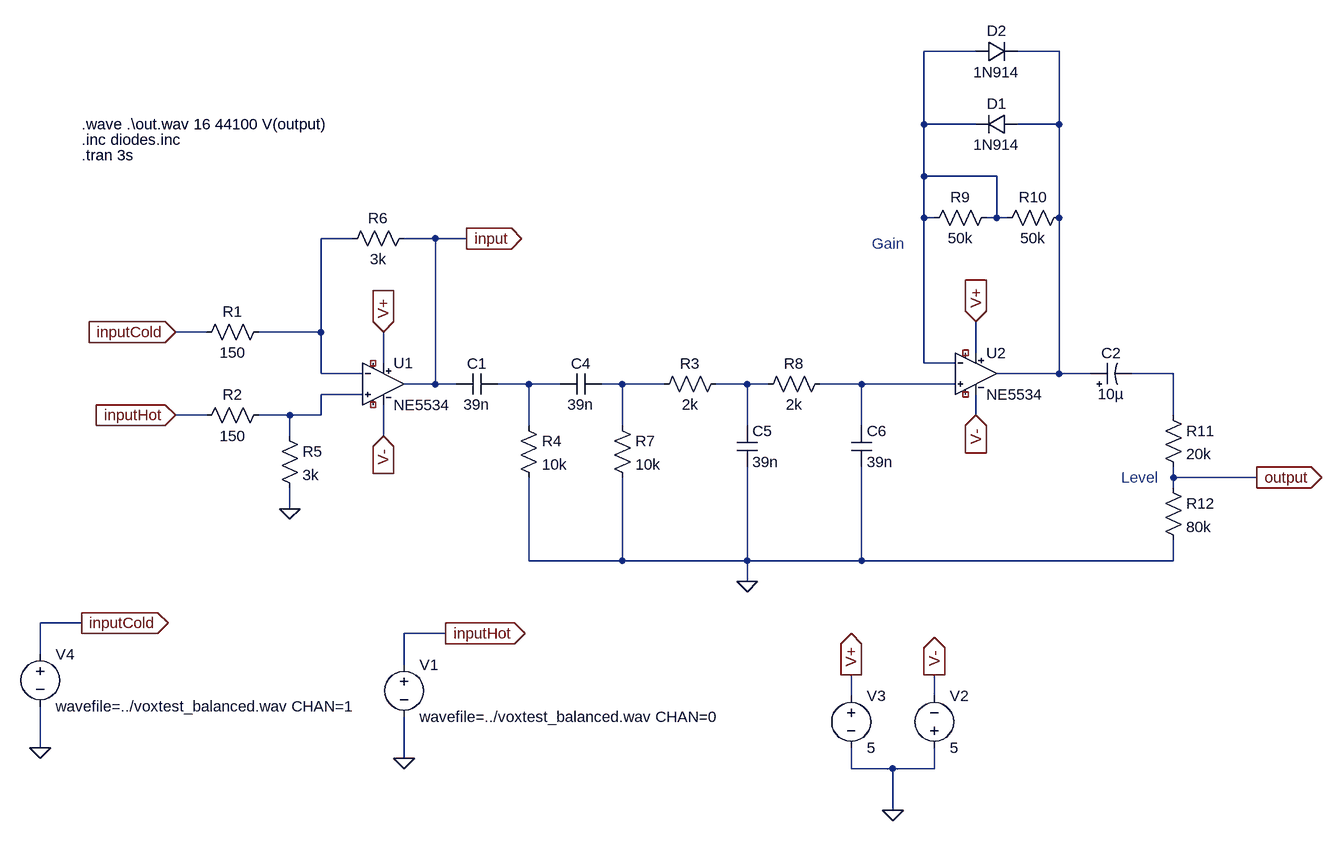
[diagram p0: schematic Telephoner.asc]
Telephoner.asc, the LTspice schematic file:
Version 4
SHEET 1 1324 900
WIRE -3984 -1632 -4064 -1632
WIRE -3856 -1632 -3920 -1632
WIRE -4064 -1520 -4064 -1632
WIRE -3984 -1520 -4064 -1520
WIRE -3856 -1520 -3856 -1632
WIRE -3856 -1520 -3920 -1520
WIRE -4064 -1440 -4064 -1520
WIRE -3952 -1440 -4064 -1440
WIRE -4064 -1376 -4064 -1440
WIRE -4048 -1376 -4064 -1376
WIRE -3952 -1376 -3952 -1440
WIRE -3952 -1376 -3968 -1376
WIRE -3936 -1376 -3952 -1376
WIRE -3856 -1376 -3856 -1520
WIRE -4944 -1344 -4992 -1344
WIRE -4816 -1344 -4864 -1344
WIRE -4768 -1344 -4816 -1344
WIRE -5168 -1200 -5216 -1200
WIRE -4992 -1200 -4992 -1344
WIRE -4992 -1200 -5088 -1200
WIRE -3984 -1168 -3984 -1216
WIRE -4896 -1152 -4896 -1200
WIRE -4064 -1152 -4064 -1376
WIRE -4016 -1152 -4064 -1152
WIRE -4992 -1136 -4992 -1200
WIRE -4928 -1136 -4992 -1136
WIRE -3856 -1136 -3856 -1376
WIRE -3856 -1136 -3952 -1136
WIRE -3808 -1136 -3856 -1136
WIRE -3680 -1136 -3744 -1136
WIRE -4816 -1120 -4816 -1344
WIRE -4816 -1120 -4864 -1120
WIRE -4784 -1120 -4816 -1120
WIRE -4672 -1120 -4720 -1120
WIRE -4624 -1120 -4672 -1120
WIRE -4528 -1120 -4560 -1120
WIRE -4464 -1120 -4528 -1120
WIRE -4336 -1120 -4384 -1120
WIRE -4304 -1120 -4336 -1120
WIRE -4160 -1120 -4224 -1120
WIRE -4016 -1120 -4160 -1120
WIRE -4928 -1104 -4992 -1104
WIRE -5168 -1072 -5216 -1072
WIRE -5040 -1072 -5088 -1072
WIRE -4992 -1072 -4992 -1104
WIRE -4992 -1072 -5040 -1072
WIRE -3984 -1072 -3984 -1104
WIRE -3680 -1072 -3680 -1136
WIRE -4672 -1056 -4672 -1120
WIRE -4528 -1056 -4528 -1120
WIRE -4336 -1056 -4336 -1120
WIRE -4160 -1056 -4160 -1120
WIRE -5040 -1040 -5040 -1072
WIRE -4896 -1040 -4896 -1088
WIRE -3680 -976 -3680 -992
WIRE -3552 -976 -3680 -976
WIRE -3680 -960 -3680 -976
WIRE -5040 -928 -5040 -960
WIRE -4672 -848 -4672 -976
WIRE -4528 -848 -4528 -976
WIRE -4528 -848 -4672 -848
WIRE -4336 -848 -4336 -992
WIRE -4336 -848 -4528 -848
WIRE -4160 -848 -4160 -992
WIRE -4160 -848 -4336 -848
WIRE -3680 -848 -3680 -880
WIRE -3680 -848 -4160 -848
WIRE -4336 -816 -4336 -848
WIRE -5360 -752 -5424 -752
WIRE -4800 -736 -4864 -736
WIRE -5424 -704 -5424 -752
WIRE -4864 -688 -4864 -736
WIRE -4176 -640 -4176 -672
WIRE -4048 -640 -4048 -672
WIRE -5424 -560 -5424 -624
WIRE -4864 -544 -4864 -608
WIRE -4176 -528 -4176 -560
WIRE -4112 -528 -4176 -528
WIRE -4048 -528 -4048 -560
WIRE -4048 -528 -4112 -528
WIRE -4112 -464 -4112 -528
FLAG -4864 -544 0
FLAG -4800 -736 inputHot
IOPIN -4800 -736 Out
FLAG -5216 -1072 inputHot
IOPIN -5216 -1072 In
FLAG -4176 -672 V+
IOPIN -4176 -672 Out
FLAG -4336 -816 0
FLAG -3984 -1216 V+
IOPIN -3984 -1216 In
FLAG -3984 -1072 V-
IOPIN -3984 -1072 In
FLAG -4048 -672 V-
IOPIN -4048 -672 Out
FLAG -4112 -464 0
FLAG -5424 -560 0
FLAG -5360 -752 inputCold
IOPIN -5360 -752 Out
FLAG -5216 -1200 inputCold
IOPIN -5216 -1200 In
FLAG -5040 -928 0
FLAG -4896 -1200 V+
IOPIN -4896 -1200 In
FLAG -4896 -1040 V-
IOPIN -4896 -1040 In
FLAG -3552 -976 output
IOPIN -3552 -976 Out
FLAG -4768 -1344 input
IOPIN -4768 -1344 Out
SYMBOL voltage -4864 -704 R0
SYMATTR InstName V1
SYMATTR Value wavefile=../voxtest_balanced.wav CHAN=0
SYMBOL voltage -4176 -656 R0
WINDOW 123 0 0 Left 2
WINDOW 39 0 0 Left 2
SYMATTR InstName V3
SYMATTR Value 5
SYMBOL cap -4720 -1136 R90
WINDOW 0 0 32 VBottom 2
WINDOW 3 32 32 VTop 2
SYMATTR InstName C1
SYMATTR Value 39n
SYMBOL cap -4560 -1136 R90
WINDOW 0 0 32 VBottom 2
WINDOW 3 32 32 VTop 2
SYMATTR InstName C4
SYMATTR Value 39n
SYMBOL res -4688 -1072 R0
SYMATTR InstName R4
SYMATTR Value 10k
SYMBOL res -4544 -1072 R0
SYMATTR InstName R7
SYMATTR Value 10k
SYMBOL res -4368 -1136 R90
WINDOW 0 0 56 VBottom 2
WINDOW 3 32 56 VTop 2
SYMATTR InstName R3
SYMATTR Value 2k
SYMBOL res -4208 -1136 R90
WINDOW 0 0 56 VBottom 2
WINDOW 3 32 56 VTop 2
SYMATTR InstName R8
SYMATTR Value 2k
SYMBOL cap -4352 -1056 R0
SYMATTR InstName C5
SYMATTR Value 39n
SYMBOL cap -4176 -1056 R0
SYMATTR InstName C6
SYMATTR Value 39n
SYMBOL res -3952 -1392 R90
WINDOW 0 0 56 VBottom 2
WINDOW 3 32 56 VTop 2
SYMATTR InstName R9
SYMATTR Value 50k
SYMBOL res -3840 -1392 R90
WINDOW 0 0 56 VBottom 2
WINDOW 3 32 56 VTop 2
SYMATTR InstName R10
SYMATTR Value 50k
SYMBOL diode -3920 -1536 R90
WINDOW 0 0 32 VBottom 2
WINDOW 3 32 32 VTop 2
SYMATTR InstName D1
SYMATTR Value 1N914
SYMBOL diode -3984 -1616 R270
WINDOW 0 32 32 VTop 2
WINDOW 3 0 32 VBottom 2
SYMATTR InstName D2
SYMATTR Value 1N914
SYMBOL res -3696 -1088 R0
SYMATTR InstName R11
SYMATTR Value 20k
SYMBOL res -3696 -976 R0
SYMATTR InstName R12
SYMATTR Value 80k
SYMBOL voltage -4048 -544 M180
WINDOW 0 24 96 Left 2
WINDOW 3 24 16 Left 2
WINDOW 123 0 0 Left 2
WINDOW 39 0 0 Left 2
SYMATTR InstName V2
SYMATTR Value 5
SYMBOL voltage -5424 -720 R0
SYMATTR InstName V4
SYMATTR Value wavefile=../voxtest_balanced.wav CHAN=1
SYMBOL res -5072 -1216 R90
WINDOW 0 0 56 VBottom 2
WINDOW 3 32 56 VTop 2
SYMATTR InstName R1
SYMATTR Value 150
SYMBOL res -5072 -1088 R90
WINDOW 0 0 56 VBottom 2
WINDOW 3 32 56 VTop 2
SYMATTR InstName R2
SYMATTR Value 150
SYMBOL res -5056 -1056 R0
SYMATTR InstName R5
SYMATTR Value 3k
SYMBOL res -4848 -1360 R90
WINDOW 0 0 56 VBottom 2
WINDOW 3 32 56 VTop 2
SYMATTR InstName R6
SYMATTR Value 3k
SYMBOL NE5534 -4896 -1072 R0
SYMATTR InstName U1
SYMBOL NE5534 -3984 -1088 R0
SYMATTR InstName U2
SYMBOL polcap -3808 -1120 R270
WINDOW 0 32 32 VTop 2
WINDOW 3 0 32 VBottom 2
SYMATTR InstName C2
SYMATTR Value 10µ
TEXT -5360 -1520 Left 2 !.wave .\\out.wav 16 44100 V(output)
TEXT -5360 -1472 Left 2 !.tran 3s
TEXT -5360 -1496 Left 2 !.inc diodes.inc
TEXT -4144 -1336 Left 2 ;Gain
TEXT -3760 -976 Left 2 ;Level

The netlist it stands for:
* Telephoner.asc
V1 inputHot 0 wavefile=../voxtest_balanced.wav CHAN=0
V3 V+ 0 5
C1 N005 input 39n
C4 N006 N005 39n
R4 N005 0 10k
R7 N006 0 10k
R3 N007 N006 2k
R8 N008 N007 2k
C5 N007 0 39n
C6 N008 0 39n
R9 N001 N001 50k
R10 N002 N001 50k
D1 N002 N001 1N914
D2 N001 N002 1N914
R11 N004 output 20k
R12 output 0 80k
V2 0 V- 5
V4 inputCold 0 wavefile=../voxtest_balanced.wav CHAN=1
R1 N003 inputCold 150
R2 N009 inputHot 150
R5 N009 0 3k
R6 input N003 3k
XU1 N009 N003 V+ V- input NC_01 NC_02 NE5534  ; pins 1 2 3 4 out comp1 comp2
XU2 N008 N001 V+ V- N002 NC_03 NC_04 NE5534  ; pins 1 2 3 4 out comp1 comp2
C2 N002 N004 10µ
.model D D
.lib standard.dio
.wave .\out.wav 16 44100 V(output)
.tran 3s
.inc diodes.inc
* Gain
* Level
.lib NE5534.inc
.backanno
.end